# Altium schematic sheet Schaltbox.SchDoc: Schaltbox für PC I/O Karte Remote PC
size A3; Organization: Schleißheimer GmbH; Address2: Am Kalkofen 10; Address3: D-61206 Wöllstadt; Address4: Deutschland; Revision: 1.0; SheetNumber: 1; SheetTotal: 1; DocumentName: Schaltbox.SchDoc
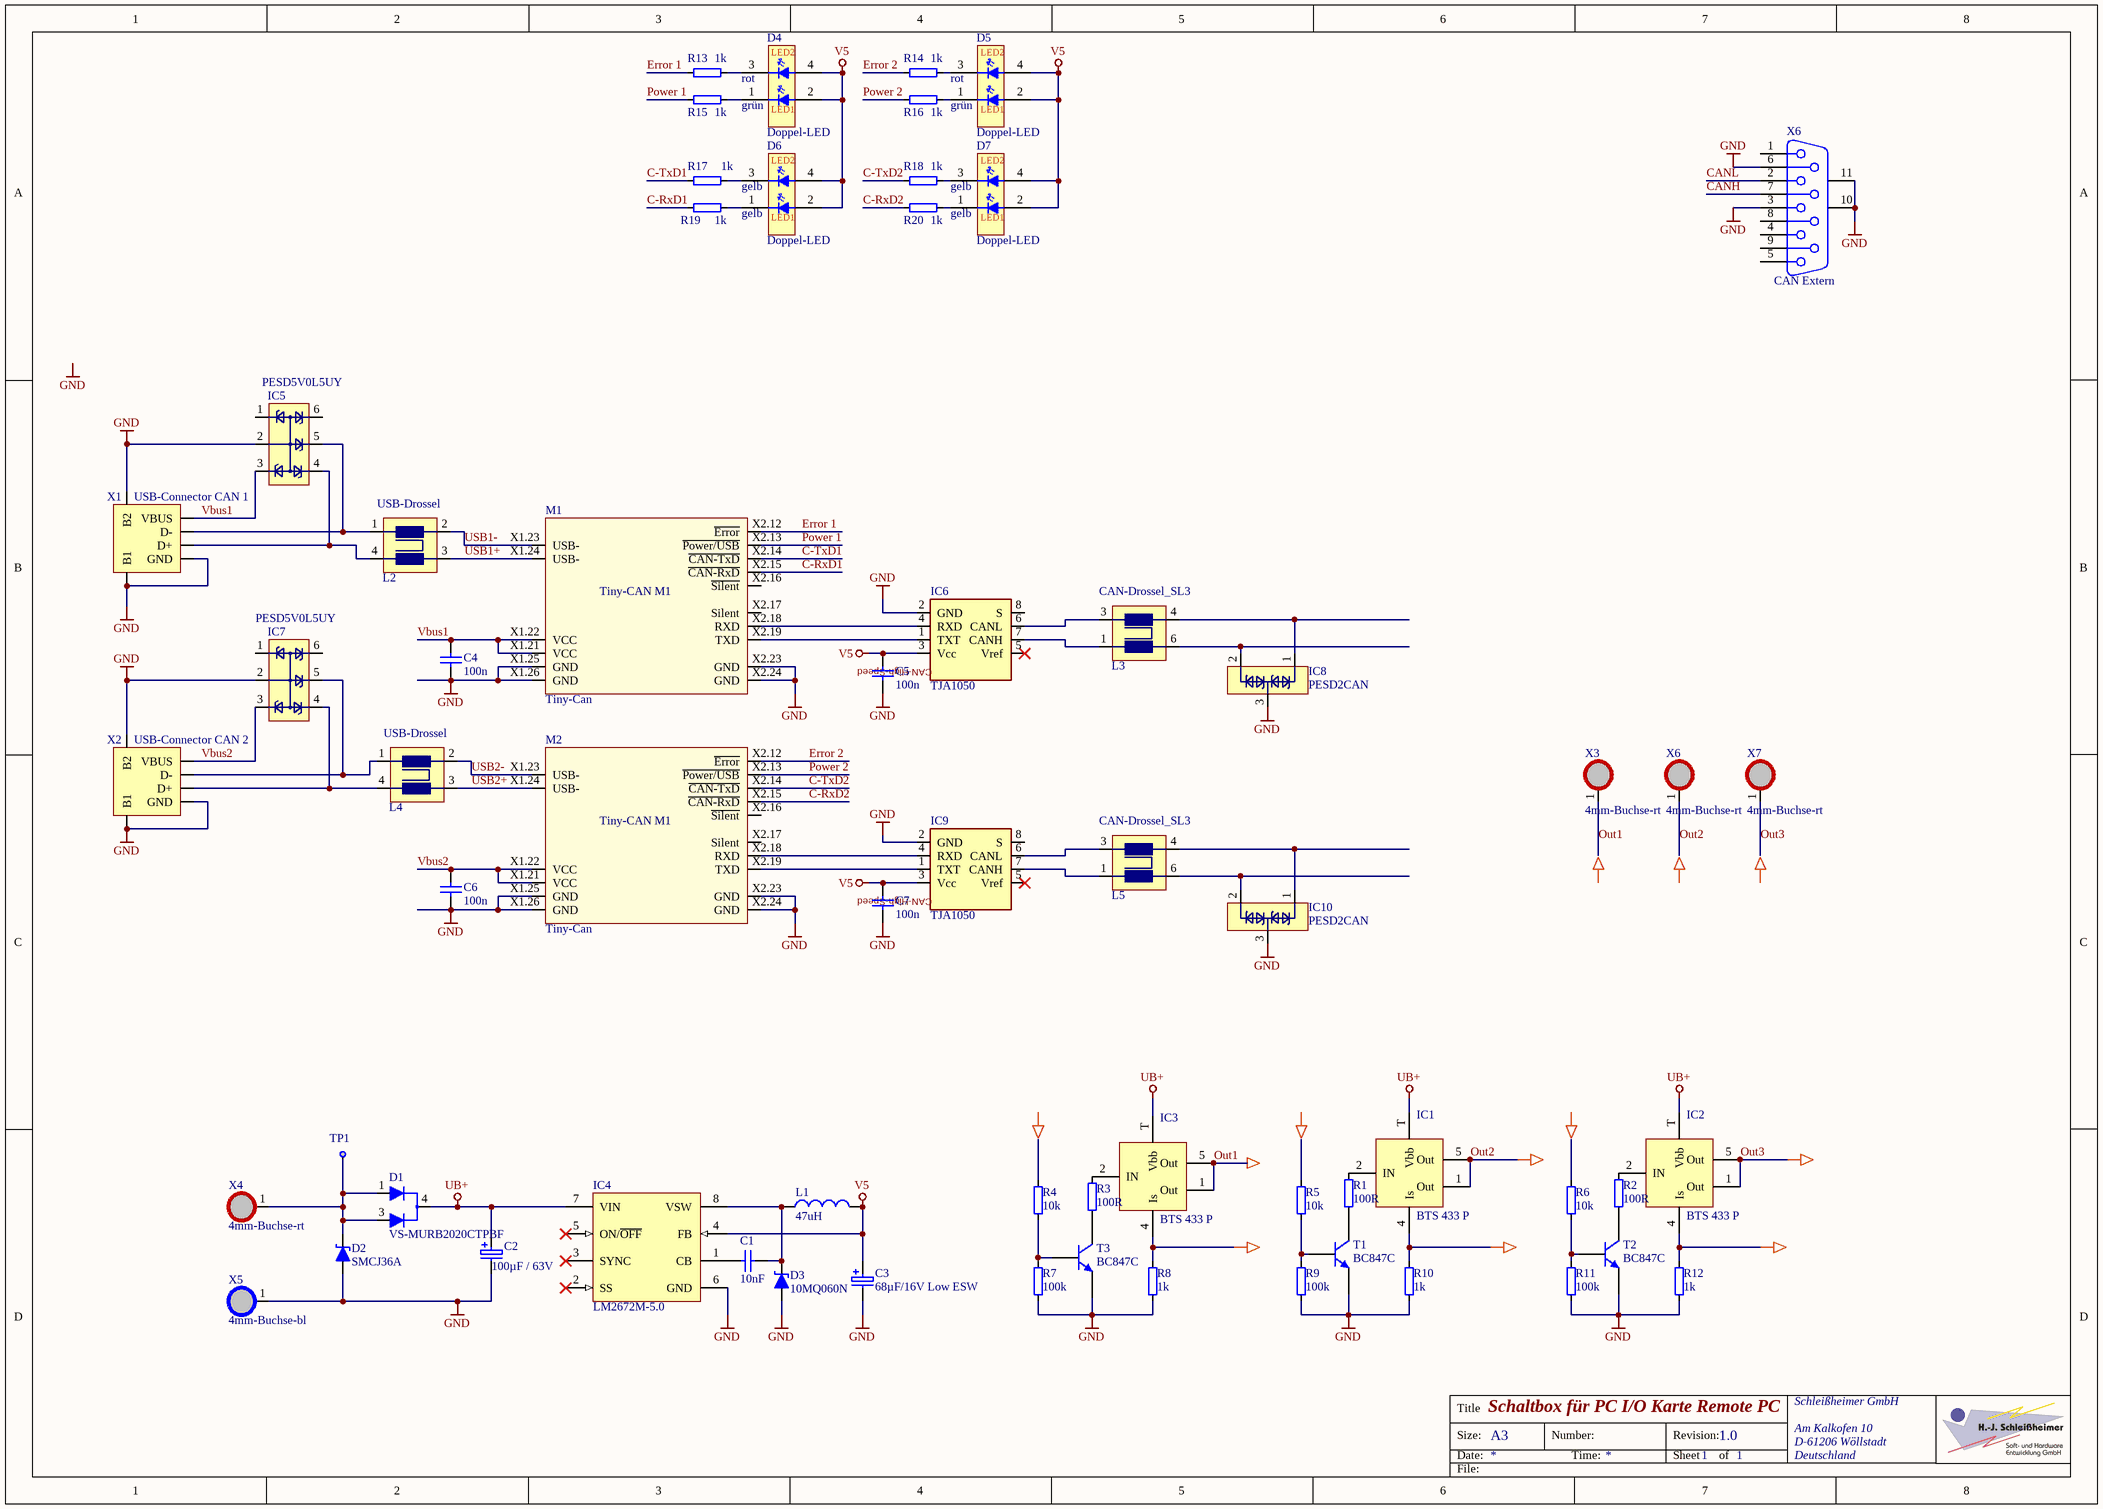
[diagram p0: Schaltbox.SchDoc]

## Parts
(Parts that share a designator on the sheet are numbered #1, #2 ... from top to bottom, then left to right.)
*#1  Pfeil-->  (value not drawn)  (graphical)
*#2  Pfeil-->  (value not drawn)  (graphical)
*#3  Pfeil-->  (value not drawn)  (graphical)
*#4  Pfeil-->  (value not drawn)  (graphical)
*#5  Pfeil-->  (value not drawn)  (graphical)
*#6  Pfeil-->  (value not drawn)  (graphical)
*#7  Pfeil-->  (value not drawn)  (graphical)
*#8  Pfeil-->  (value not drawn)  (graphical)
*#9  Pfeil-->  (value not drawn)  (graphical)
*#10  Pfeil-->  (value not drawn)  (graphical)
*#11  Pfeil-->  (value not drawn)  (graphical)
*#12  Pfeil-->  (value not drawn)  (graphical)
C1  10nF  [C0603MD]
C2  100µF / 63V  [ALU-G]
C3  68µF/16V Low ESW  [ALU-D]
C4  100n  [C0603MD]
C5  100n  [C0603MD]
C6  100n  [C0603MD]
C7  100n  [C0603MD]
D1  VS-MURB2020CTPBF  [TO252-3_LD_(DPAK)]
D2  SMCJ36A  [SMC_MD_(DO214AB)]
D3  10MQ060N  [SMA_LD_(DO214AC)]
D4  Doppel-LED  [Duo-LED 3mm]
D5  Doppel-LED  [Duo-LED 3mm]
D6  Doppel-LED  [Duo-LED 3mm]
D7  Doppel-LED  [Duo-LED 3mm]
IC1  BTS 433 P  [TO252-5_MD_(DPAK)]
IC2  BTS 433 P  [TO252-5_MD_(DPAK)]
IC3  BTS 433 P  [TO252-5_MD_(DPAK)]
IC4  LM2672M-5.0  [M08A_N]
IC5  PESD5V0L5UY  [SOT363_MD_(SC88 / SC70-6)]
IC6  TJA1050  [SOIC8_LD_(SO8)]
IC7  PESD5V0L5UY  [SOT363_MD_(SC88 / SC70-6)]
IC8  PESD2CAN  [SOT23_MD]
IC9  TJA1050  [SOIC8_LD_(SO8)]
IC10  PESD2CAN  [SOT23_MD]
L1  47uH  [L_B82464-G4]
L2  USB-Drossel  [Drossel-USB]
L3  CAN-Drossel_SL3  [CAN-Drossel-SL3]
L4  USB-Drossel  [Drossel-USB]
L5  CAN-Drossel_SL3  [CAN-Drossel-SL3]
M1  Tiny-Can  [Tiny-CAN M1]
M2  Tiny-Can  [Tiny-CAN M1]
R1  100R  [R0603HD]
R2  100R  [R0603HD]
R3  100R  [R0603HD]
R4  10k  [R0603HD]
R5  10k  [R0603HD]
R6  10k  [R0603HD]
R7  100k  [R0603HD]
R8  1k  [R0603HD]
R9  100k  [R0603HD]
R10  1k  [R0603HD]
R11  100k  [R0603HD]
R12  1k  [R0603HD]
R13  1k  [R0603MD]
R14  1k  [R0603MD]
R15  1k  [R0603MD]
R16  1k  [R0603MD]
R17  1k  [R0603MD]
R18  1k  [R0603MD]
R19  1k  [R0603MD]
R20  1k  [R0603MD]
T1  BC847C  [SOT23_L]
T2  BC847C  [SOT23_L]
T3  BC847C  [SOT23_L]
TP1  Testpoint  [TESTPAD-1.2mm]  (value not drawn)  (no BOM)
X1  USB-Connector CAN 1  [USB_TypB]
X2  USB-Connector CAN 2  [USB_TypB]
X3  4mm-Buchse-rt  [4mm-Bu_ liegend-rt]
X4  4mm-Buchse-rt  [4mm-Bu_ liegend-rt]
X5  4mm-Buchse-bl  [4mm-Bu_ liegend-sw]
X6#1  CAN Extern  [DSUB1.385-2H9]
X6#2  4mm-Buchse-rt  [4mm-Bu_ liegend-rt]
X7  4mm-Buchse-rt  [4mm-Bu_ liegend-rt]

## Nets
GND: C2.N C3.N C4.1 C5.1 C6.1 C7.1 D2.2 D3.2(A) IC4.6(GND) IC5.2 IC6.2(GND) IC7.2 IC8.3 IC9.2(GND) IC10.3 M1.X1.25(GND) M1.X1.26(GND) M1.X2.23(GND) M1.X2.24(GND) M2.X1.25(GND) M2.X1.26(GND) M2.X2.23(GND) M2.X2.24(GND) R7.1 R8.1 R9.1 R10.1 R11.1 R12.1 T1.2(E) T2.2(E) T3.2(E) X1.B1 X1.B2 X1.GND X2.B1 X2.B2 X2.GND X5.1 X6#1.3 X6#1.6 X6#1.10(MH1) X6#1.11(MH2)
UB+: C2.P D1.4(K) IC1.T(Vbb) IC2.T(Vbb) IC3.T(Vbb) IC4.7(VIN)
V5: C3.P C5.2 C7.2 D4.2 D4.4 D5.2 D5.4 D6.2 D6.4 D7.2 D7.4 IC4.4(FB) IC6.3(Vcc) IC9.3(Vcc) L1.2
C-RxD1: M1.X2.15(~{CAN-RxD}) R19.1
C-RxD2: M2.X2.15(~{CAN-RxD}) R20.1
C-TxD1: M1.X2.14(~{CAN-TxD}) R17.1
C-TxD2: M2.X2.14(~{CAN-TxD}) R18.1
CANH: X6#1.7
CANL: X6#1.2
Error 1: M1.X2.12(~{Error}) R13.1
Error 2: M2.X2.12(~{Error}) R14.1
Out1: IC3.1(Out) IC3.5(Out) X3.1
Out2: IC1.1(Out) IC1.5(Out) X6#2.1
Out3: IC2.1(Out) IC2.5(Out) X7.1
Power 1: M1.X2.13(~{Power/USB}) R15.1
Power 2: M2.X2.13(~{Power/USB}) R16.1
USB1+: L2.3(O_2) M1.X1.24(USB-)
USB1-: L2.2(O_1) M1.X1.23(USB-)
USB2+: L4.3(O_2) M2.X1.24(USB-)
USB2-: L4.2(O_1) M2.X1.23(USB-)
Vbus1: C4.2 IC5.3 M1.X1.21(VCC) M1.X1.22(VCC) X1.VBUS
Vbus2: C6.2 IC7.3 M2.X1.21(VCC) M2.X1.22(VCC) X2.VBUS
NetC1_1: C1.1 D3.1(K) IC4.8(VSW) L1.1
NetC1_2: C1.2 IC4.1(CB)
NetD1_1: D1.1(A1) D1.3(A2) D2.1 TP1.1(tp) X4.1
NetD4_1: D4.1 R15.2
NetD4_3: D4.3 R13.2
NetD5_1: D5.1 R16.2
NetD5_3: D5.3 R14.2
NetD6_1: D6.1 R19.2
NetD6_3: D6.3 R17.2
NetD7_1: D7.1 R20.2
NetD7_3: D7.3 R18.2
NetIC1_2: IC1.2(IN) R1.2
NetIC1_4: IC1.4(Is) R10.2
NetIC2_2: IC2.2(IN) R2.2
NetIC2_4: IC2.4(Is) R12.2
NetIC3_2: IC3.2(IN) R3.2
NetIC3_4: IC3.4(Is) R8.2
NetIC5_4: IC5.4 L2.4(I_2) X1.D+
NetIC5_5: IC5.5 L2.1(I_1) X1.D-
NetIC6_1: IC6.1(TXT) M1.X2.19(TXD)
NetIC6_4: IC6.4(RXD) M1.X2.18(RXD)
NetIC6_6: IC6.6(CANL) L3.3(I2)
NetIC6_7: IC6.7(CANH) L3.1(I_1)
NetIC7_4: IC7.4 L4.4(I_2) X2.D+
NetIC7_5: IC7.5 L4.1(I_1) X2.D-
NetIC8_1: IC8.1 L3.4(O_1)
NetIC8_2: IC8.2 L3.6(O1)
NetIC9_1: IC9.1(TXT) M2.X2.19(TXD)
NetIC9_4: IC9.4(RXD) M2.X2.18(RXD)
NetIC9_6: IC9.6(CANL) L5.3(I2)
NetIC9_7: IC9.7(CANH) L5.1(I_1)
NetIC10_1: IC10.1 L5.4(O_1)
NetIC10_2: IC10.2 L5.6(O1)
NetR1_1: R1.1 T1.3(C)
NetR2_1: R2.1 T2.3(C)
NetR3_1: R3.1 T3.3(C)
NetR4_1: R4.1 R7.2 T3.1(B)
NetR5_1: R5.1 R9.2 T1.1(B)
NetR6_1: R6.1 R11.2 T2.1(B)

Not connected (* = marked no-connect by the designer): IC4 2(SS)* 3(SYNC)* 5(ON/~{OFF})*; IC5 1 6; IC6 5(Vref)* 8(S); IC7 1 6; IC9 5(Vref)* 8(S); M1 X2.16(~{Silent}) X2.17(Silent); M2 X2.16(~{Silent}) X2.17(Silent); R4 2; R5 2; R6 2; X6#1 1 4 5 8 9

## Notes on the sheet
- (near D4) rot
- (near D4) grün
- rot
- (near D5) grün
- (near D6) gelb
- (near D7) gelb
- Labels drawn without touching a wire or pin: GND
- Title
- Size:
- Date:
- A3
- Number:
- Time:
- Revision:
- Sheet
- of
- File:
- (in symbol Doppel-LED) LED2; LED1
- (in symbol TJA1050_1) CAN-High-Speed

## Library data of the parts
*#1-*#12 = Pfeil-->: No Footprint
C1 = Cap: Capacitor; Published: 8-Jun-2000; LatestRevisionDate: 17-Jul-2002; LatestRevisionNote: Re-released for DXP Platform.; PackageReference: RAD-0.3; Publisher: Altium Limited; Value: 10nF
C2 C3 = Cap Pol: Capacitor Polarized; Published: 8-Jun-2000; LatestRevisionDate: 17-Jul-2002; LatestRevisionNote: Re-released for DXP Platform.; PackageReference: C0805; Publisher: Altium Limited
  C2: Value: 100µF / 63V
  C3: Value: 68µF/16V Low ESW
C4-C7 = Cap: Capacitor; Value: 100p; Published: 8-Jun-2000; LatestRevisionDate: 17-Jul-2002; LatestRevisionNote: Re-released for DXP Platform.; PackageReference: RAD-0.3; Publisher: Altium Limited
D1 = MURD620CT: Schottky Barrier Double Diode; Published: 17-Sep-2003; LatestRevisionDate: 12-Dec-2006; LatestRevisionNote: IPC-7351 Footprint Added.; DatasheetVersion: 4-Mar-2002; PackageVersion: May-1999; PackageReference: SOT23; Publisher: Altium Limited; PackageDescription: 3-Pin SOT-23 Package 0.95 mm Pitch, 2.3 mm Lead Span; ComponentLink1Description: Manufacturer Link; ComponentLink1URL: http://www.semiconductors.philips.com/; ComponentLink2Description: Datasheet; ComponentLink2URL: http://www.semiconductors.philips.com/acrobat/datasheets/BAT54_SERIES_4.pdf
D2 = SMCJ36A: Suppressor Diode, unidirektional, 36V, 1500 W, fFotprint SMC
D3 = 10MQ060NPbF: Schotky Diode 2,1A 60V, footprint SMA
D4-D7 = Doppel-LED: Doppel-LED  90° PCB-Mount
IC1-IC3 = BTS443 P
IC4 = LM2672M-5.0: SIMPLE SWITCHER® Power Converter High Efficiency 1A Step-Down Voltage Regulator with Features, 8-pin Narrow SOIC; Manufacturer: National Semiconductor; PackageTopMarking: NSZXTT*2672*M5.0; PowerWise: N; Published: 4-Dec-2008; DatasheetVersion: Apr-2007; PackageVersion: revM, May-2009; PackageReference: M08A; Publisher: Altium Limited; PackageDescription: SOIC Narrow, 4.9 x 3.9 x 1.45mm, 8 Lead, 1.27mm Pitch; Supplier 1: Farnell; Supplier Part Number 1: 9489797; PartNumber: LM2672M-5.0; RoHS: N; PinCount: 8; CompType: Switcher; Code_JEDEC: MS-012-AA; Code_IPC: SOIC127P600-8; ComponentLink1Description: LM2672 Datasheet; ComponentLink1URL: http://www.national.com/ds/LM/LM2672.pdf; ComponentLink2Description: LM2672 Web Page; ComponentLink2URL: http://www.national.com/pf/LM/LM2672.html; ComponentLink3Description: M08A Package Page; ComponentLink3URL: http://www.national.com/packaging/folders/m08a.html
IC5 IC7 = PESD5V0L5UY: ESD_Protection 5 Lines
IC6 IC9 = TJA1050_1: CAN-Transceiver
IC8 IC10 = PESD2CAN: ESD-Protection CAN-Bus
L1 = Inductor: Code_IEC: 1005; Published: 8-Jun-2000; LatestRevisionDate: 17-Jul-2002; LatestRevisionNote: Re-released for DXP Platform.; PackageReference: 0402-A; Publisher: Altium Limited; Code_JEITA: 0402; Value: 47uH
L2 L4 = USB-Drossel: USB 2.0-Drossel, Commen-Mode Noise Supressor
L3 L5 = CAN-Drossel_SL3: CAN-Drossel, Würth 744252510, 51µH
M1 M2 = Tiny-CAN M1: MHS-Tiny-CAN M1, USB-CAN Modul
R1-R20 = Res: Resistor
  R1-R3: VALUE: 100R
  R4-R6: VALUE: 10k
  R7 R9 R11: VALUE: 100k
  R8 R10 R12: VALUE: 1k
T1-T3 = BC847C: NPN General-purpose Transistor; Published: 17-Sep-2003; LatestRevisionDate: 12-Dec-2006; LatestRevisionNote: IPC-7351 Footprint Added.; DatasheetVersion: 4-Feb-2002; PackageVersion: May-1999; PackageReference: SOT23; Publisher: Altium Limited; PackageDescription: 3-Pin SOT-23 Package 0.95 mm Pitch, 2.3 mm Lead Span; ComponentLink1Description: Manufacturer Link; ComponentLink1URL: http://www.semiconductors.philips.com/; ComponentLink2Description: Datasheet; ComponentLink2URL: http://www.semiconductors.philips.com/acrobat/datasheets/BC846_BC847_BC848_5.pdf
X1 X2 = USB-Typ AB: USB-Stecker-Typ A und B,THT
X3 X4 X6#2 X7 = 4mm-Buchse-rt: Bananen-Stecker 4mm
X5 = 4mm-Buchse-bl: Bananen-Stecker 4mm
X6#1 = D Connector 9: Receptacle Assembly, 9 Position, Right Angle; PackageDocument: O; Positions: 9; Published: 15-Jun-2001; LatestRevisionDate: 17-Jul-2002; LatestRevisionNote: Re-released for DXP Platform.; DatasheetDocument: 1-Sep-1999; PackageReference: 788750; Publisher: Altium Limited; Orientation: Right Angle; Gender: Receptacle